# EAGLE design Temp (EAGLE 9.6.2)
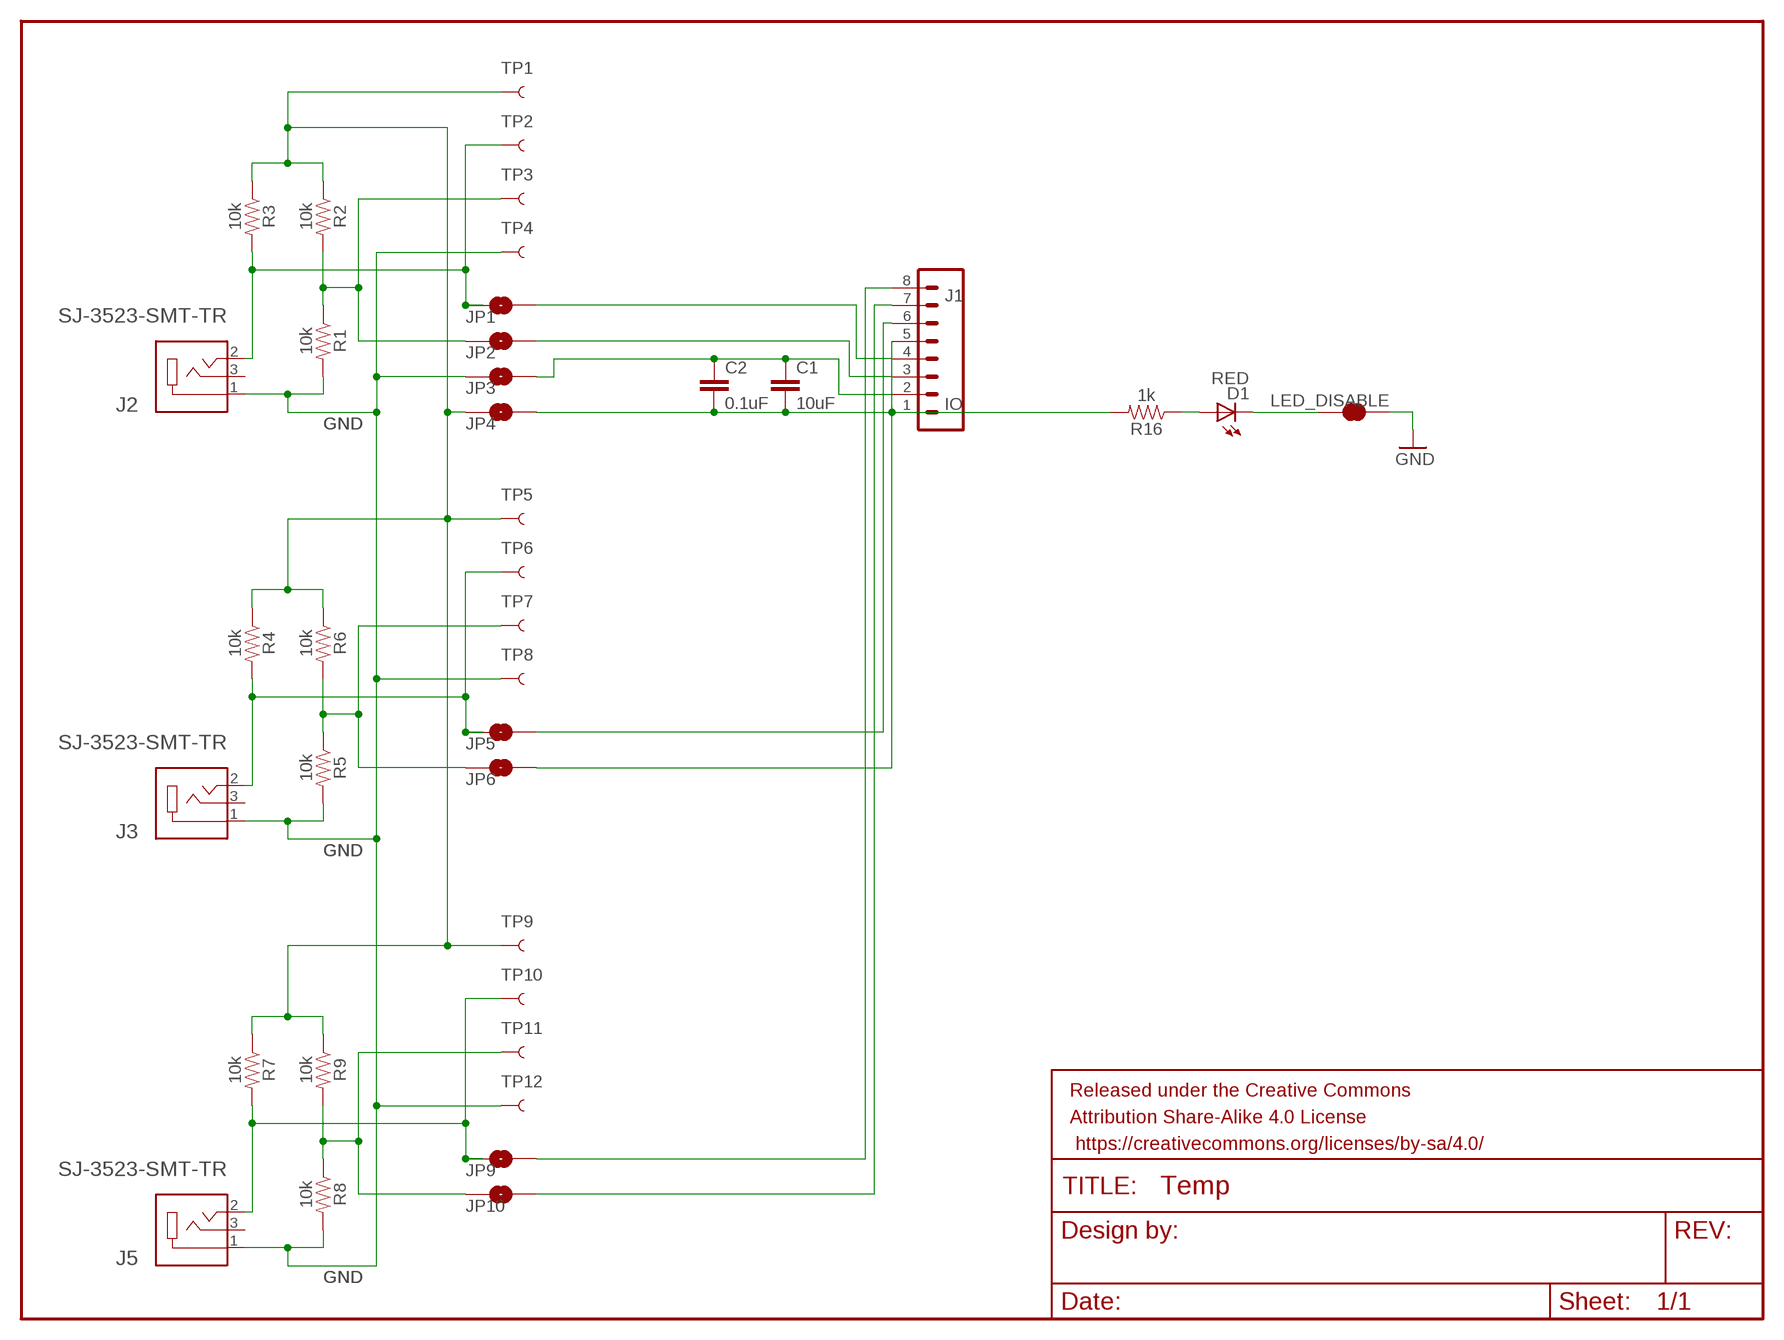
[diagram p0: schematic, sheet 1]

## Parts
C1  10uF  10UF-0603-6.3V-20%  [0603]
C2  0.1uF  0.1UF-0603-25V-(+80/-20%)  [0603]
D1  RED  LED-RED0603  [LED-0603]
FRAME1  FRAME-LETTERNO_PACKAGE  [DUMMY]
J1  IO  CONN_08"  [1X08]
J2  SJ-3523-SMT-TR  [CUI_SJ-3523-SMT-TR]
J3  SJ-3523-SMT-TR  [CUI_SJ-3523-SMT-TR]
J5  SJ-3523-SMT-TR  [CUI_SJ-3523-SMT-TR]
JP1  JUMPER-SMT_2_NO_NO-SILK  [SMT-JUMPER_2_NO_NO-SILK]
JP2  JUMPER-SMT_2_NO_NO-SILK  [SMT-JUMPER_2_NO_NO-SILK]
JP3  JUMPER-SMT_2_NO_NO-SILK  [SMT-JUMPER_2_NO_NO-SILK]
JP4  JUMPER-SMT_2_NO_NO-SILK  [SMT-JUMPER_2_NO_NO-SILK]
JP5  JUMPER-SMT_2_NO_NO-SILK  [SMT-JUMPER_2_NO_NO-SILK]
JP6  JUMPER-SMT_2_NO_NO-SILK  [SMT-JUMPER_2_NO_NO-SILK]
JP9  JUMPER-SMT_2_NO_NO-SILK  [SMT-JUMPER_2_NO_NO-SILK]
JP10  JUMPER-SMT_2_NO_NO-SILK  [SMT-JUMPER_2_NO_NO-SILK]
LED_DISABLE  JUMPER-SMT_2_NC_TRACE_SILK  [SMT-JUMPER_2_NC_TRACE_SILK]
R1  10k  10KOHM-0603-1/10W-1%  [0603]
R2  10k  10KOHM-0603-1/10W-1%  [0603]
R3  10k  10KOHM-0603-1/10W-1%  [0603]
R4  10k  10KOHM-0603-1/10W-1%  [0603]
R5  10k  10KOHM-0603-1/10W-1%  [0603]
R6  10k  10KOHM-0603-1/10W-1%  [0603]
R7  10k  10KOHM-0603-1/10W-1%  [0603]
R8  10k  10KOHM-0603-1/10W-1%  [0603]
R9  10k  10KOHM-0603-1/10W-1%  [0603]
R16  1k  1KOHM-0603-1/10W-1%  [0603]
TP1  TEST-POINT3X5  [PAD.03X.05]
TP2  TEST-POINT3X5  [PAD.03X.05]
TP3  TEST-POINT3X5  [PAD.03X.05]
TP4  TEST-POINT3X5  [PAD.03X.05]
TP5  TEST-POINT3X5  [PAD.03X.05]
TP6  TEST-POINT3X5  [PAD.03X.05]
TP7  TEST-POINT3X5  [PAD.03X.05]
TP8  TEST-POINT3X5  [PAD.03X.05]
TP9  TEST-POINT3X5  [PAD.03X.05]
TP10  TEST-POINT3X5  [PAD.03X.05]
TP11  TEST-POINT3X5  [PAD.03X.05]
TP12  TEST-POINT3X5  [PAD.03X.05]

## Nets
3.3V: JP4.1 R2.1 R3.1 R4.1 R6.1 R7.1 R9.1 TP1.P$1 TP5.P$1 TP9.P$1
GND: J2.1 J3.1 J5.1 JP3.1 LED_DISABLE.1 R1.2 R5.2 R8.2 TP4.P$1 TP8.P$1 TP12.P$1
N$1: JP6.1 R5.1 R6.2 TP7.P$1
N$3: JP2.1 R1.1 R2.2 TP3.P$1
N$5: J1.3 JP2.2
N$6: J2.2 JP1.1 R3.2 TP2.P$1
N$7: J1.4 JP1.2
N$8: J3.2 JP5.1 R4.2 TP6.P$1
N$9: J1.7 JP10.2
N$10: J1.8 JP9.2
N$11: J1.6 JP5.2
N$13: JP10.1 R8.1 R9.2 TP11.P$1
N$14: J5.2 JP9.1 R7.2 TP10.P$1
N$15: C1.2 C2.2 J1.1 JP4.2 R16.2
N$16: C1.1 C2.1 J1.2 J1.5 JP3.2 JP6.2
N$26: D1.A R16.1
N$28: D1.C LED_DISABLE.2
Unconnected: J2.3 J3.3 J5.3

## Library data of the parts
C1 = SparkFun-Capacitors:10UF: 10.0µF ceramic capacitors A capacitor is a passive two-terminal electrical component used to store electrical energy temporarily in an electric field.; PROD_ID: CAP-11015
C2 = SparkFun-Capacitors:0.1UF: 0.1µF ceramic capacitors A capacitor is a passive two-terminal electrical component used to store electrical energy temporarily in an electric field.; PROD_ID: CAP-00810
D1 = SparkFun-LED:LED-RED: Assorted Red LEDs LilyPad 1206- DIO-09912 1206- DIO-00809 0603- DIO-00819; PROD_ID: DIO-00819
FRAME1 = SparkFun-Aesthetics:FRAME-LETTER: Schematic Frame - Letter Standard 8.5x11 US Letter frame; DESIGNER: Nobody; VERSION: v01
J1 = SparkFun-Connectors:CONN_08: Multi connection point. Often used as Generic Header-pin footprint for 0.1 inch spaced/style header connections On any of the 0.1 inch spaced packages, you can populate with these: Break Away Headers - Straight <https://www.sparkfun.com/products/116> (PRT-00116) Break Away Male Headers - Right Angle <https://www.sparkfun.com/products/553> (PRT-00553) Female Headers <https://www.sparkfun.com/products/115> (PRT-00115) Break Away Headers - Machine Pin <https://www.sparkfun.com/products/117> (PRT-00117) Break Away Female Headers - Swiss Machine Pin <https://www.sparkfun.com/products/743> (PRT-00743) Arduino Stackable Header - 8 Pin <https://www.sparkfun.com/products/9279> (PRT-09279) For SCREWTERMINALS and SPRING TERMINALS visit here: Screw Terimnals on SparkFun.com <https://www.sparkfun.com/search/results?term=Screw+Terminals> (5mm/3.5mm/2.54mm spacing) This device is also useful as a general connection point to wire up your design to another part of your project. Our various solder wires solder well into these plated through hole pads. Hook-Up Wire - Assortment (Stranded, 22 AWG) <https://www.sparkfun.com/products/11375> (PRT-11375) Hook-Up Wire - Assortment (Solid Core, 22 AWG) <https://www.sparkfun.com/products/11367> (PRT-11367) View the entire wire category on our website here <https://www.sparkfun.com/categories/141> Special notes: Molex polarized connector foot print use with SKU : PRT-08231 with associated crimp pins and housings. 1MM SMD Version SKU: PRT-10208 NOTES ON THE VARIANTS LOCK and LOCK_LONGPADS... This footprint was designed to help hold the alignment of a through-hole component (i.e. 6-pin header) while soldering it into place. You may notice that each hole has been shifted either up or down by 0.005 of an inch from it's more standard position (which is a perfectly straight line). This slight alteration caused the pins (the squares in the middle) to touch the edges of the holes. Because they are alternating, it causes a "brace" to hold the component in place. 0.005 has proven to be the perfect amount of "off-center" position when using our standard breakaway headers. Although looks a little odd when you look at the bare footprint, once you have a header in there, the alteration is very hard to notice. Also,if you push a header all the way into place, it is covered up entirely on the bottom side.; PROD_ID: CONN-08438
J2 J3 J5 = SJ-3523-SMT-TR:SJ-3523-SMT-TR: Audio Jack Connector 3.5 mm Low Profile Surface Mount Stereo Jack, 3 Pin Right-Angle Check availability <https://pricing.snapeda.com/parts/SJ-3523-SMT-TR/CUI%20Devices/view-part?ref=eda>; AVAILABILITY: In Stock; CUI_PURCHASE_URL: https://www.cuidevices.com/product/interconnect/connectors/audio-connectors/jacks/sj-352x-smt-series?utm_source=snapeda.com&utm_medium=referral&utm_campaign=snapedaBOM; DESCRIPTION: 3.5 mm, Stereo, Right Angle, Surface Mount (SMT), 3 Conductors, 0~1 Internal Switches, Audio Jack Connector; MF: CUI Devices; MP: SJ-3523-SMT-TR; PACKAGE: None; PRICE: None; PURCHASE-URL: https://pricing.snapeda.com/search/part/SJ-3523-SMT-TR/?ref=eda
JP1-JP6 JP9 JP10 = SparkFun-Jumpers:JUMPER-SMT_2_NO: Normally open jumper This jumper has two pads in close proximity to each other. Apply solder to close the connection. Round pads are easier to solder for beginners, but are a lot larger. SparkFun Product that uses the round pads: SparkFun EL Sequencer <https://www.sparkfun.com/products/12781>
LED_DISABLE = SparkFun-Jumpers:JUMPER-SMT_2_NC_TRACE: Normally closed trace jumper This jumper has a trace between two pads so it's normally closed (NC). Use a razor knife to open the connection. For best results follow the IPC guidelines for cutting traces: Cutout at least 0.063 mm (0.005 in). Remove all loose material to clean up the cut area. Seal the cut with an approved epoxy. Reapply solder to reclose the connection.
R1-R9 = SparkFun-Resistors:10KOHM: 10kΩ resistor A resistor is a passive two-terminal electrical component that implements electrical resistance as a circuit element. Resistors act to reduce current flow, and, at the same time, act to lower voltage levels within circuits. - Wikipedia; PROD_ID: RES-00824
R16 = SparkFun-Resistors:1KOHM: 1kΩ resistor A resistor is a passive two-terminal electrical component that implements electrical resistance as a circuit element. Resistors act to reduce current flow, and, at the same time, act to lower voltage levels within circuits. - Wikipedia; PROD_ID: RES-07856
TP1-TP12 = SparkFun-Connectors:TEST-POINT: SparkFun Test Points Bare copper test points for troubleshooting or In-Circuit-Testing. These are used by our Production team for verifying production board runs using pogo-pins on test beds. SparkFun Products: SparkFun LSM9DS1 Breakout <https://www.sparkfun.com/products/13284> SparkFun PSOC <https://www.sparkfun.com/products/13714> SparkFun Load Cell Amplifier <https://www.sparkfun.com/products/13879>

## Board
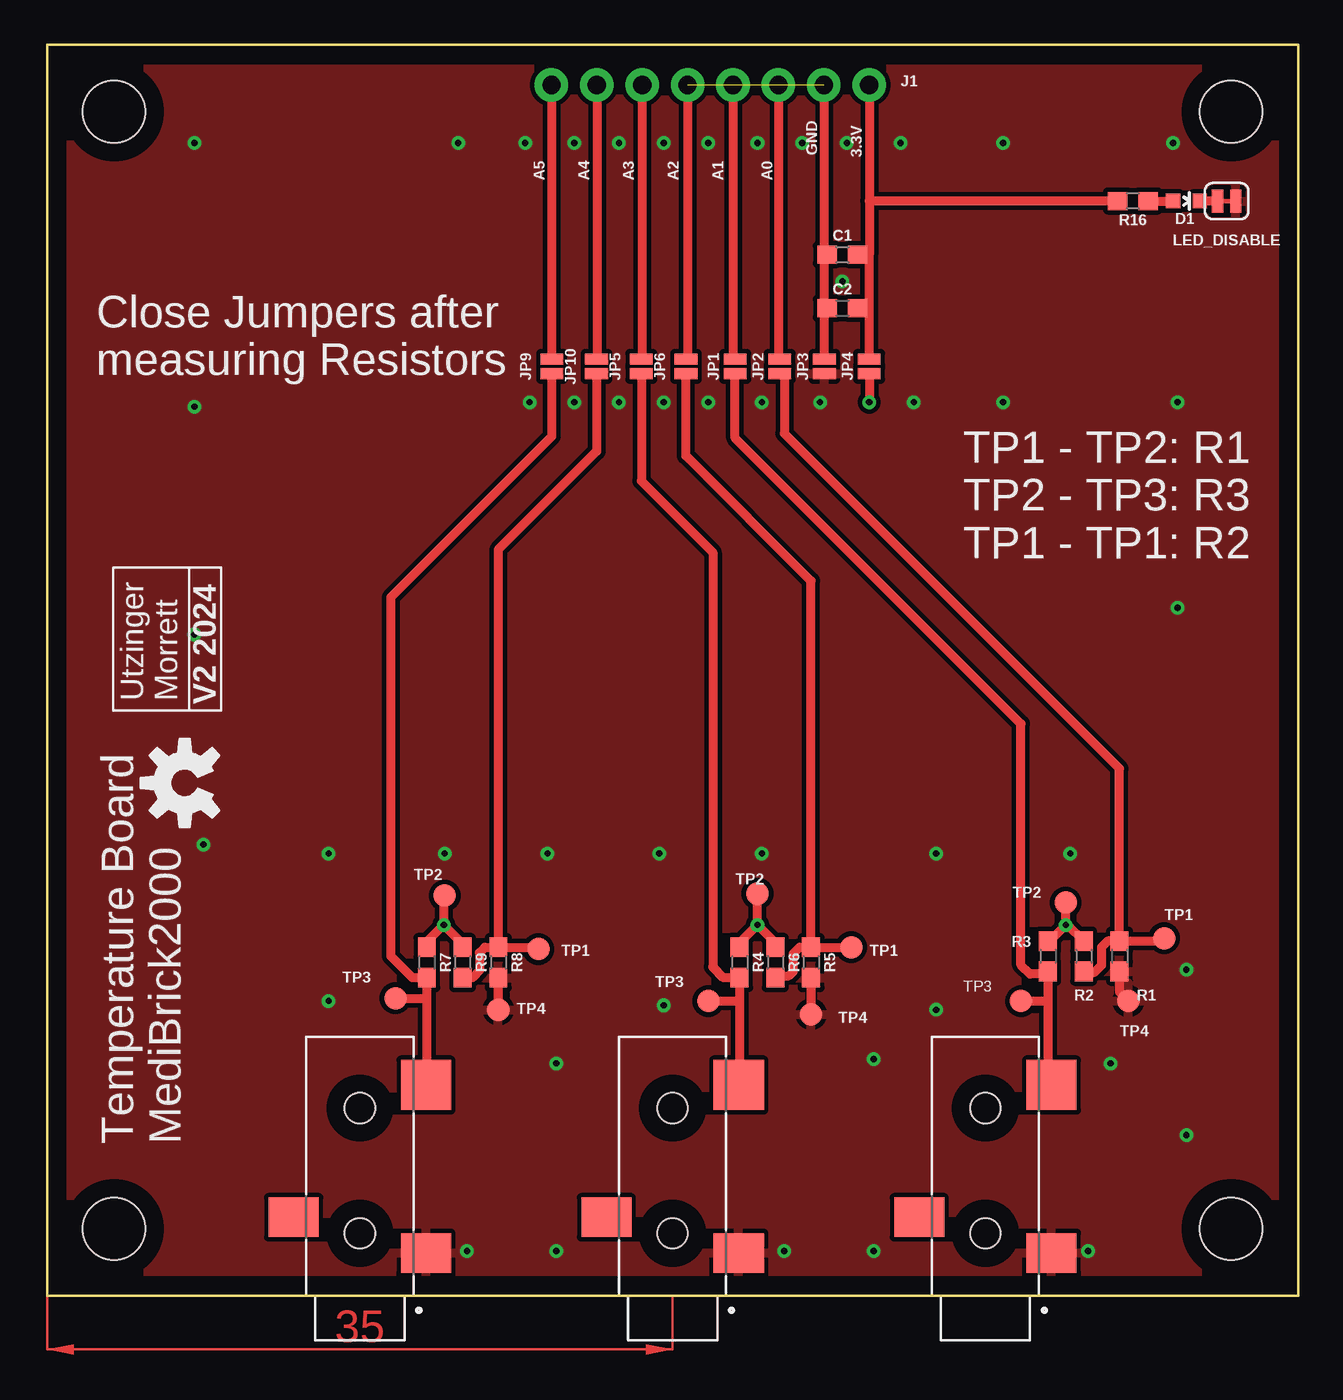
[diagram p1: board, top side]
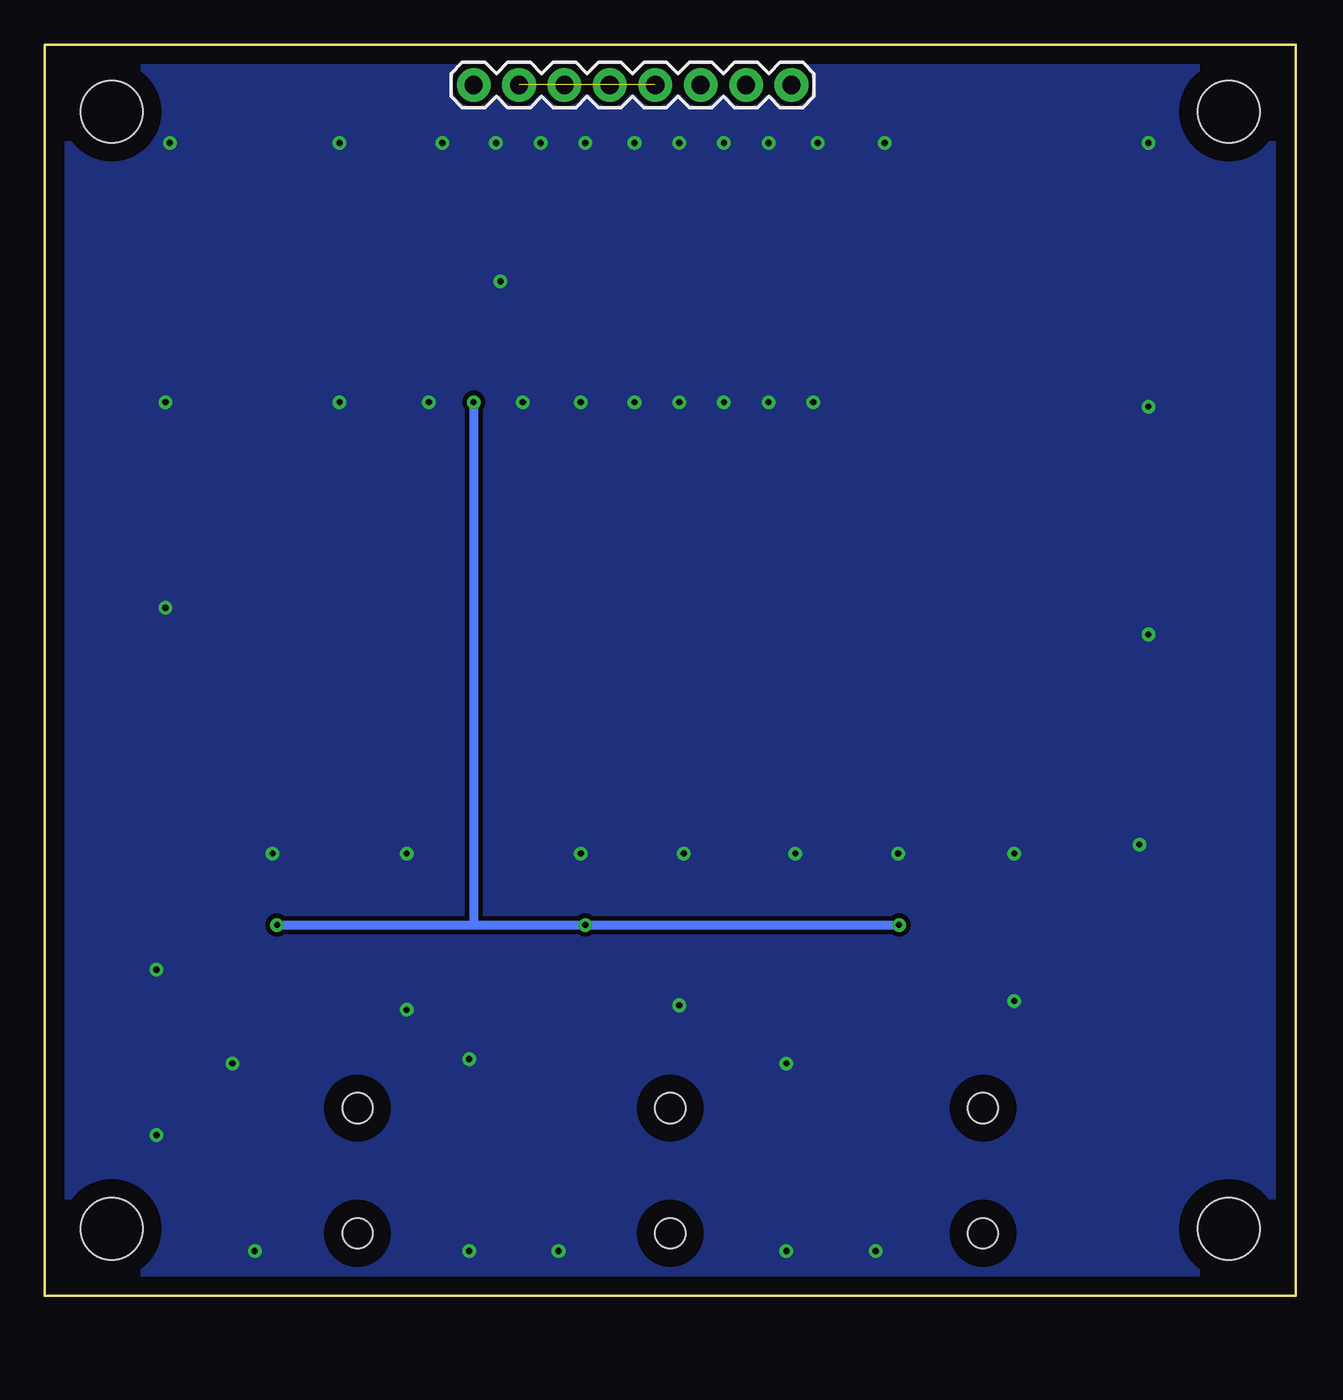
[diagram p2: board, bottom side, seen from below]

Size 70 x 70 mm. Coordinates in mm from the lower left corner, seen from the top.
Outline: 0,0 0,70 70,70 70,0 0,0
Copper layers (1*16): Top 0.035mm / dielectric 1.5mm / Bottom 0.035mm
Design rules "default": minimum track width 6mil, minimum drill 0.35mm, track to track 6mil, track to pad 6mil, pad to pad 6mil, via to via 6mil, smd to smd 6mil, copper to edge 40mil, drill to drill 6mil, minimum pad ring 10mil, minimum via ring 8mil, stop-mask expansion 4mil, vias tented up to drill 0mil, thermal gap 10mil
Holes 3.5 mm at 3.75,66.25 66.25,66.25 66.25,3.75 3.75,3.75

### Footprints (pad centres in the part's own frame; a part is rotated, then mirrored left to right if it is on the bottom)
0603 = smd 1.1 x 1: 1 -0.85,0; 2 0.85,0
LED-0603 = smd 0.8 x 0.8: A 0,-0.75; C 0,0.75
1X08 = drill 1.016 pad 1.88: 1 0,0; 2 2.54,0; 3 5.08,0; 4 7.62,0; 5 10.16,0; 6 12.7,0; 7 15.24,0; 8 17.78,0
CUI_SJ-3523-SMT-TR = smd 2.2 x 2.8: 1 -1.1,-3.7; 3 0.9,3.7 | smd 2.8 x 2.8: 2 8.3,-3.7 | hole 1.7: 0,0; 7,0
SMT-JUMPER_2_NO_NO-SILK = smd 0.635 x 1.27: 1 -0.406,0; 2 0.406,0
SMT-JUMPER_2_NC_TRACE_SILK = smd 0.635 x 1.27: 1 -0.508,0; 2 0.508,0
PAD.03X.05 = smd 1.27 x 1.27: P$1 0,0

### Placement (x,y rotation side)
C1  44.5,58.25 0 top
C2  44.5,55.25 0 top
D1  63.75,61.25 270 top
FRAME1  -0.25,-5.25 0 top  (outside the outline)
J1  46,67.75 0 bottom
J2  52.5,3.5 90 top
J3  35,3.5 90 top
J5  17.5,3.5 90 top
JP1  38.5,52 90 top
JP2  41,52 90 top
JP3  43.5,52 90 top
JP4  46,52 90 top
JP5  33.25,52 90 top
JP6  35.75,52 90 top
JP9  28.25,52 90 top
JP10  30.75,52 90 top
LED_DISABLE  66,61.25 180 top
R1  60,19 270 top
R2  58,19 270 top
R3  56,19 270 top
R4  38.75,18.65 270 top
R5  42.75,18.65 270 top
R6  40.75,18.65 270 top
R7  21.25,18.65 270 top
R8  25.25,18.65 270 top
R9  23.25,18.65 270 top
R16  60.75,61.25 180 top
TP1  57,22 0 top
TP2  54.5,16.5 0 top
TP3  62.5,20 0 top
TP4  60.5,16.5 0 top
TP5  39.75,22.5 0 top
TP6  37,16.5 0 top
TP7  45,19.5 0 top
TP8  42.75,15.75 0 top
TP9  22.25,22.4 0 top
TP10  19.5,16.65 0 top
TP11  27.5,19.4 0 top
TP12  25.25,16 0 top
U$1  [OSHW-LOGO-M]  7.7,28.7 90 top

### Tracks (layer width: path | path; a pad name or v marks a point on that pad's centre or on a via)
3.3V  (via drill 0.35)
  Top 0.508: 57,21.5 TP1.P$1 v57,20.75 | JP4.1 v46,50 | v57,20.75 56.1,19.85 R3.1 | v57,20.75 57.1,20.75 R2.1 | R7.1 21.25,19.8 v22.2,20.75 | v22.2,20.75 23.15,19.8 23.25,19.81 R9.1 | TP9.P$1 22.2,22.35 v22.2,20.75 | v39.75,20.75 38.75,19.75 R4.1 | v39.75,20.75 40.75,19.75 R6.1 | v39.75,20.75 TP5.P$1
  Bottom 0.508: v57,20.75 46,20.75 | 46,20.75 v39.75,20.75 v22.2,20.75 | v46,50 46,20.75
GND  (via drill 0.35)
  Top 0.508: R8.2 TP12.P$1 | R1.2 60,17 TP4.P$1 | R5.2 TP8.P$1
  other vias: 43.25,50 40,50 37,50 48.5,50 23.5,2.5 53.5,50 53.5,64.5 23,64.5 8.25,64.5 63.75,9 44.75,64.5 37,64.5 39.75,64.5 42.25,64.5 40,24.75 57.25,24.75 49.75,16 63.75,18.25 49.75,24.75 46.25,13.25 46.25,2.5 44.5,56.75 34.5,64.5 32,64.5 29.5,64.5 26.75,64.5 47.75,64.5 34.5,50 32,50 29.5,50 27,50 34.25,24.75 28,24.75 22.25,24.75 15.75,24.75 15.75,16.5 34.5,16.25 41.25,2.5 58.25,2.5 28.5,2.5 28.5,13 59.5,13 8.25,49.75 8.25,37 8.75,25.25 63.25,38.5 63.25,50 63,64.5
  pour Bottom (isolate 0.254): 0,70 0,0 70,0 70,70
  pour Top (isolate 0.254): 0,70 0,0 70,0 70,70
N$1
  Top 0.508: R6.2 40.85,17.9 41.5,17.9 41.75,18.15 41.75,19.15 42.1,19.5 R5.1 | R5.1 TP7.P$1 | R5.1 42.75,40 35.75,47 JP6.1
N$3
  Top 0.508: R2.2 58.05,18.1 58.6,18.1 59,18.5 59,19.5 59.35,19.85 R1.1 | R1.1 62.35,19.85 TP3.P$1 | JP2.1 41.25,51.34 41.25,48.25 60,29.5 R1.1
N$5
  Top 0.508: J1.3 40.92,52.65 | 40.92,52.65 41,52.57 | JP2.2 40.92,52.49 40.92,52.65
N$6
  Top 0.152: J2.2 56,11.8
  Top 0.508: 56,16.5 R3.2 55.85,18 55,18 54.5,18.5 54.5,32 38.5,48 JP1.1 | 56,16.5 56,11.8 | TP2.P$1 56,16.5
N$7
  Top 0.508: J1.4 38.38,52.69 | 38.38,52.69 38.5,52.57 | JP1.2 38.38,52.53 38.38,52.69
N$8
  Top 0.508: 38.75,16.5 R4.2 37.85,17.8 37.25,18.4 37.25,41.59 33.25,45.59 JP5.1 | 38.75,16.5 38.75,11.85 J3.2 | TP6.P$1 38.75,16.5
N$9
  Top 0.508: J1.7 JP10.2
N$10
  Top 0.508: J1.8 28.22,52.44 JP9.2
N$11
  Top 0.508: J1.6 33.3,52.46 JP5.2
N$13
  Top 0.508: R8.1 27.4,19.5 TP11.P$1 | 23.45,18 R9.2 23.8,17.8 24.2,18.2 24.2,19.2 24.5,19.5 R8.1 | R8.1 25.25,41.75 30.75,47.25 JP10.1
N$14
  Top 0.508: 21.25,16.7 R7.2 20.45,17.8 19.25,19 19.25,39.09 28.25,48.09 JP9.1 | 21.25,16.7 21.25,11.8 J5.2 | TP10.P$1 21.2,16.65 21.25,16.7
N$15
  Top 0.508: JP4.2 46,55.25 | 46,55.25 C2.2 | 46,55.25 46,58.25 | 46,58.25 45.88,58.38 | 45.88,58.38 45.75,58.5 45.5,58.5 | J1.1 46,61.25 | 46,61.25 46,58.25 | C1.2 45.48,58.38 45.88,58.38 | R16.2 46,61.25
N$16  (1 unrouted)
  Top 0.508: J1.2 43.46,58.06 | 43.46,52.61 43.5,52.57 | C1.1 43.46,58.06 | 43.46,58.06 43.46,55.06 | C2.1 43.46,55.06 | 43.46,55.06 43.46,52.61 | JP3.2 43.46,52.45 43.46,52.61 | J1.5 35.84,52.5 JP6.2
N$26
  Top 0.508: R16.1 D1.A
N$28
  Top 0.508: LED_DISABLE.2 D1.C
(copper drawn outside any net)
  shapes: Top area x1

### Text on the board
tNames: GND | 3.3V | A5 | A4 | A3 | A2 | A1 | A0 | Close Jumpers after / measuring Resistors | TP1 - TP2: R1 / TP2 - TP3: R3 / TP1 - TP1: R2 | Utzinger / Morrett | V2 2024 | TP2 | TP2 | TP2 | TP1 | TP1 | TP1 | TP3 | TP3 | TP3 | TP4 | TP4 | TP4 | Temperature Board / MediBrick2000